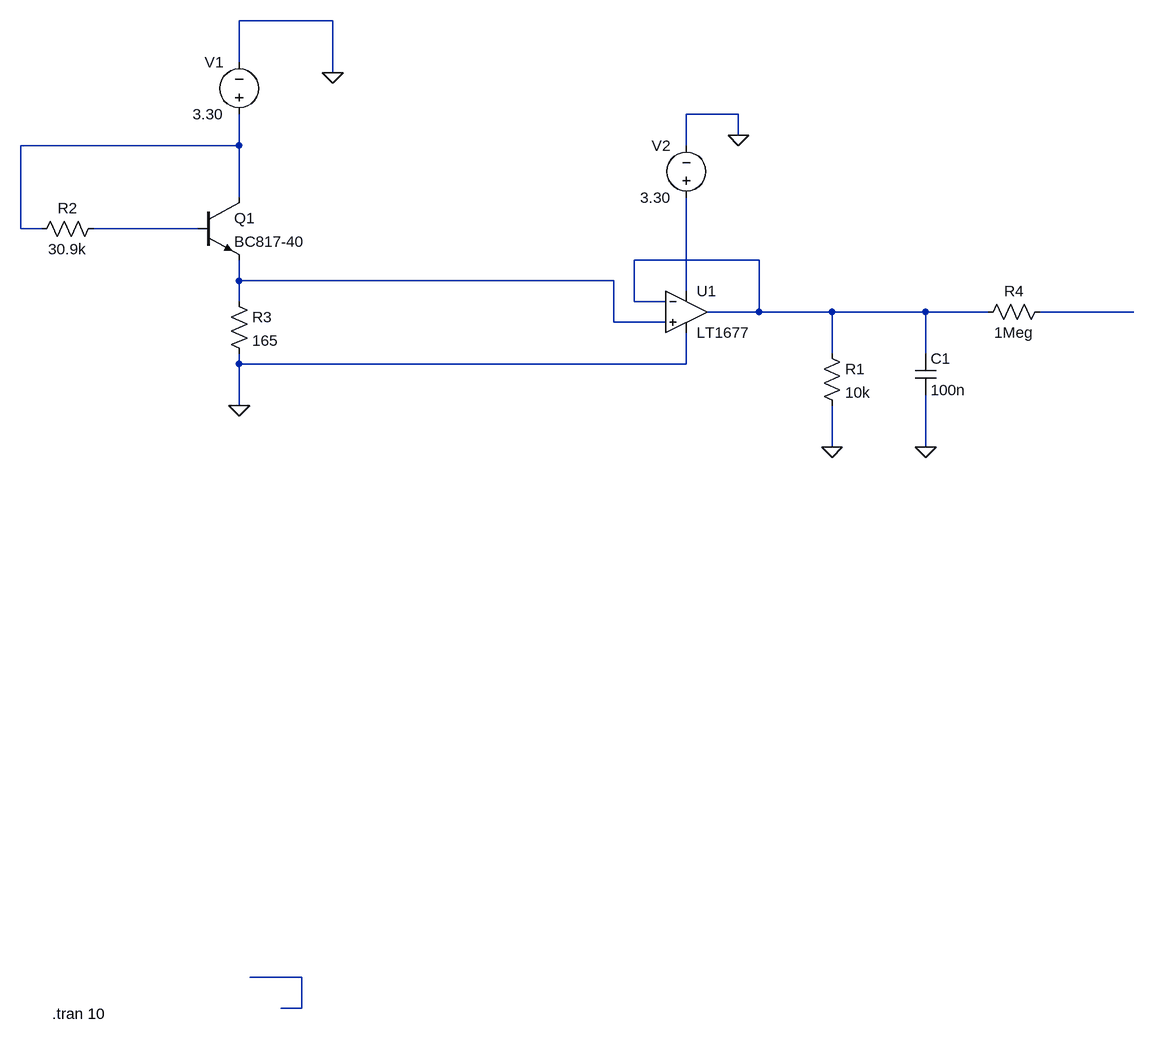
[diagram p0: schematic source+opamp.asc]
source+opamp.asc, the LTspice schematic file:
Version 4
SHEET 1 1508 680
WIRE 256 -1344 112 -1344
WIRE 112 -1280 112 -1344
WIRE 256 -1264 256 -1344
WIRE 880 -1200 800 -1200
WIRE 880 -1168 880 -1200
WIRE 112 -1152 112 -1200
WIRE 112 -1152 -224 -1152
WIRE 800 -1152 800 -1200
WIRE 112 -1072 112 -1152
WIRE -224 -1024 -224 -1152
WIRE -192 -1024 -224 -1024
WIRE 48 -1024 -112 -1024
WIRE 912 -976 720 -976
WIRE 112 -944 112 -976
WIRE 688 -944 112 -944
WIRE 800 -928 800 -1072
WIRE 112 -912 112 -944
WIRE 720 -912 720 -976
WIRE 768 -912 720 -912
WIRE 912 -896 912 -976
WIRE 912 -896 832 -896
WIRE 1024 -896 912 -896
WIRE 1168 -896 1024 -896
WIRE 1264 -896 1168 -896
WIRE 1488 -896 1344 -896
WIRE 688 -880 688 -944
WIRE 768 -880 688 -880
WIRE 1024 -832 1024 -896
WIRE 1168 -832 1168 -896
WIRE 112 -816 112 -832
WIRE 800 -816 800 -864
WIRE 800 -816 112 -816
WIRE 112 -752 112 -816
WIRE 1024 -688 1024 -752
WIRE 1168 -688 1168 -768
WIRE 208 128 128 128
WIRE 208 176 208 128
WIRE 208 176 176 176
FLAG 256 -1264 0
FLAG 112 -752 0
FLAG 1024 -688 0
FLAG 1168 -688 0
FLAG 880 -1168 0
SYMBOL npn 48 -1072 R0
SYMATTR InstName Q1
SYMATTR Value BC817-40
SYMBOL voltage 112 -1184 R180
WINDOW 0 24 96 Left 2
WINDOW 3 24 16 Left 2
WINDOW 123 0 0 Left 0
WINDOW 39 0 0 Left 0
SYMATTR InstName V1
SYMATTR Value 3.30
SYMBOL OpAmps\\LT1677 800 -960 R0
SYMATTR InstName U1
SYMBOL cap 1152 -832 R0
SYMATTR InstName C1
SYMATTR Value 100n
SYMBOL res 1008 -848 R0
SYMATTR InstName R1
SYMATTR Value 10k
SYMBOL res 1360 -912 R90
WINDOW 0 0 56 VBottom 2
WINDOW 3 32 56 VTop 2
SYMATTR InstName R4
SYMATTR Value 1Meg
SYMBOL res 96 -928 R0
SYMATTR InstName R3
SYMATTR Value 165
SYMATTR SpiceLine tol=1 pwr=0.25
SYMBOL res -96 -1040 R90
WINDOW 0 0 56 VBottom 2
WINDOW 3 32 56 VTop 2
SYMATTR InstName R2
SYMATTR Value 30.9k
SYMBOL voltage 800 -1056 R180
WINDOW 0 24 96 Left 2
WINDOW 3 24 16 Left 2
WINDOW 123 0 0 Left 0
WINDOW 39 0 0 Left 0
SYMATTR InstName V2
SYMATTR Value 3.30
TEXT -176 184 Left 2 !.tran 10

The netlist it stands for:
* source+opamp.asc
Q1 N001 N002 N004 0 BC817-40
V1 N001 0 3.30
XU1 N004 N003 N005 0 N003 LT1677  ; pins In+ In- V+ V- OUT
C1 N003 0 100n
R1 N003 0 10k
R4 N006 N003 1Meg
R3 N004 0 165 tol=1 pwr=0.25
R2 N002 N001 30.9k
V2 N005 0 3.30
.model NPN NPN
.model PNP PNP
.lib standard.bjt
.tran 10
.lib LTC.lib
.backanno
.end